# Altium schematic sheet ESP-12S.SchDoc
size A4; SheetNumber: 1; SheetTotal: 1
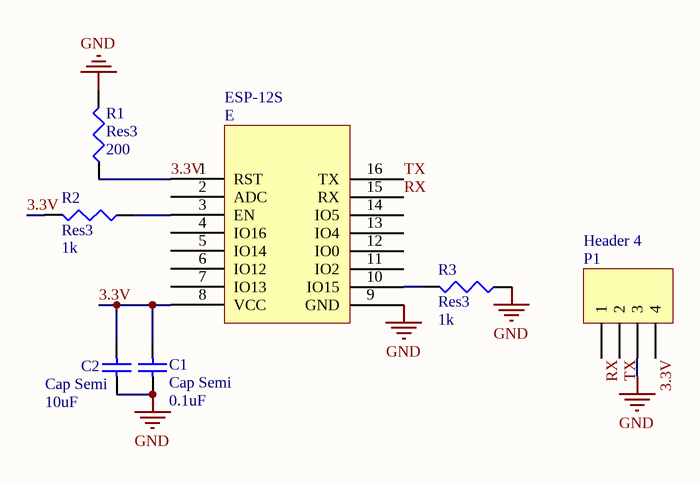
[diagram p0: ESP-12S.SchDoc]

## Parts
C1  Cap Semi  value 0.1uF  [1608[0603]]
C2  Cap Semi  value 10uF  [C2512]
E  ESP-12S  [ESP-12S]
P1  Header 4  [HDR1X4]
R1  Res3  value 200  [J1-0603]
R2  Res3  value 1k  [J1-0603]
R3  Res3  value 1k  [J1-0603]

## Nets
GND: C1.1 C2.1 E.9(GND) P1.3 R1.2 R3.1
3.3V: C1.2 C2.2 E.1(RST) E.8(VCC) P1.4 R1.1 R2.2
RX: E.15(RX) P1.1
TX: E.16(TX) P1.2
NetE_3: E.3(EN) R2.1
NetE_10: E.10(IO15) R3.2

Not connected (* = marked no-connect by the designer): E 2(ADC) 4(IO16) 5(IO14) 6(IO12) 7(IO13) 11(IO2) 12(IO0) 13(IO4) 14(IO5)

## Library data of the parts
C1 C2 = Cap Semi: Capacitor (Semiconductor SIM Model); Published: 8-Jun-2000; LatestRevisionDate: 29-May-2009; LatestRevisionNote: IPC-7351 Footprint Added.; PackageReference: C1206; Publisher: Altium Limited; PackageDescription: Chip Capacitor
P1 = Header 4: Header, 4-Pin; LatestRevisionDate: 17-Jul-2002; LatestRevisionNote: Re-released for DXP Platform.; Publisher: Altium Limited
R1-R3 = Res3: Resistor; Published: 8-Jun-2000; LatestRevisionDate: 29-May-2009; LatestRevisionNote: IPC-7351 Footprint Added.; PackageReference: J1-0603; Publisher: Altium Limited; PackageDescription: Chip Resistor